# Altium schematic sheet Curr_Source_Buffer.SchDoc
size A; SheetNumber: 15; SheetTotal: 16
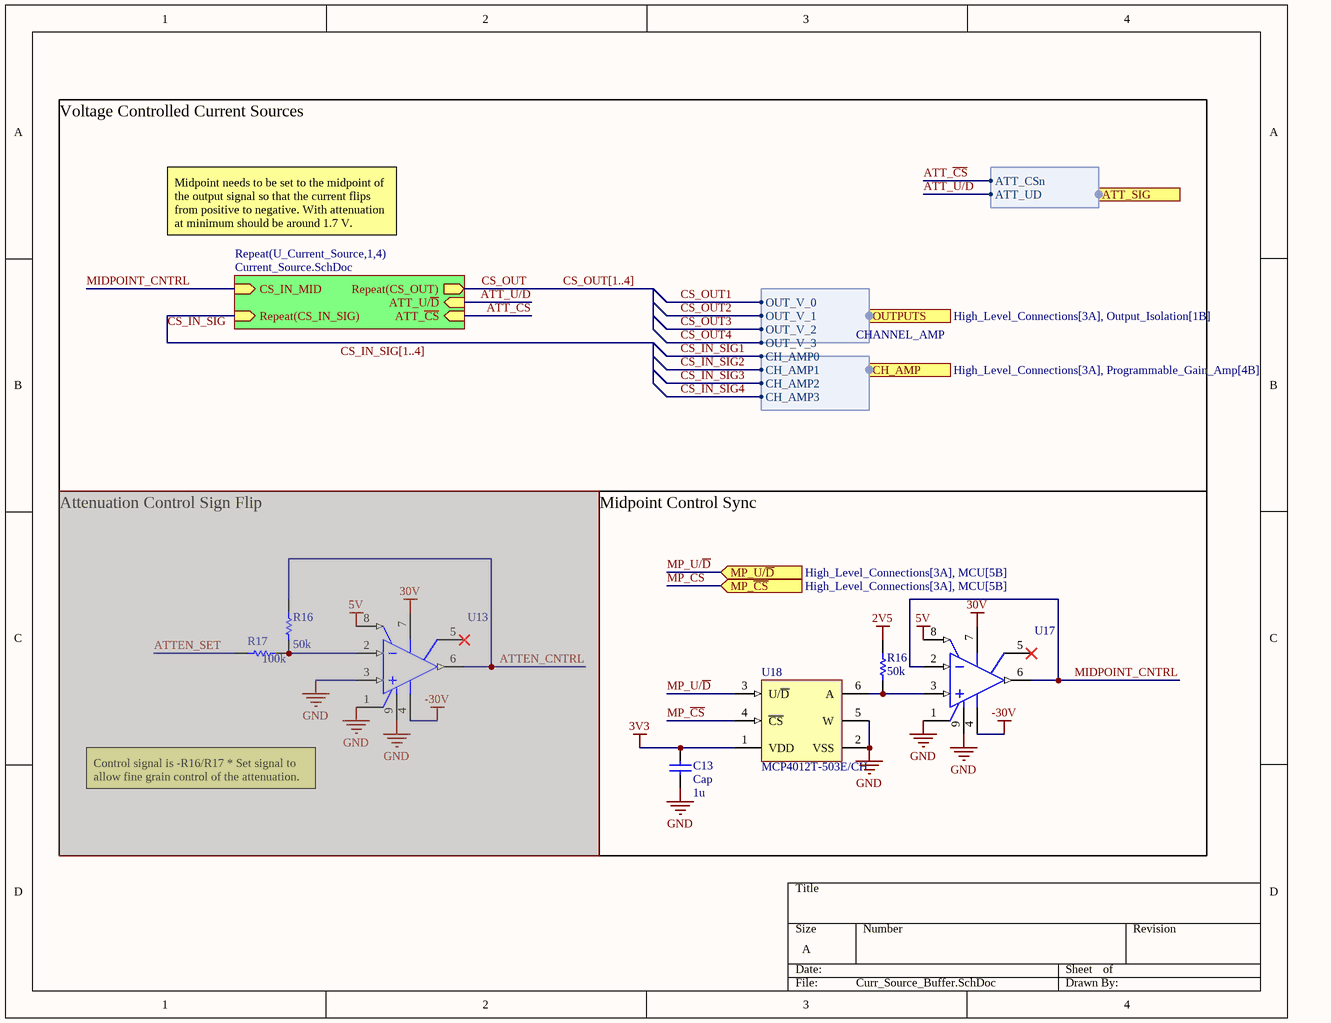
[diagram p0: Curr_Source_Buffer.SchDoc]

## Parts
(Parts that share a designator on the sheet are numbered #1, #2 ... from top to bottom, then left to right.)
C13  Cap  value 1u  [CAPC1608X05N]
R16#1  value 50k  [0402_Res]  (hidden comment: DNP)  (masked out: inside a compile mask, not in the netlist)
R16#2  value 50k  [0402_Res]  (hidden comment: DNP)
R17  value 100k  [0402_Res]  (hidden comment: DNP)  (masked out: inside a compile mask, not in the netlist)
U13  OPA454AIDDA  [DDA0008C_L]  (value not drawn)  (masked out: inside a compile mask, not in the netlist)
U17  OPA454AIDDA  [DDA0008C_L]  (value not drawn)
U18  MCP4012T-503E/CH  [SOT-23-CH6_M]

## Blocks framed on the sheet
Midpoint Control Sync: C13 R16#2 U17 U18

## Sub-sheets
Repeat(U_Current_Source,1,4) = Current_Source.SchDoc: CS_IN_MID (in), Repeat(CS_OUT) (out), Repeat(CS_IN_SIG) (in), ATT_U/~{D} (in), ATT_~{CS} (in)

## Ports
ATT_SIG (harness ATT), CH_AMP (in, harness CHANNEL_AMP, see High_Level_Connections[3A], Programmable_Gain_Amp[4B]), MP_U/~{D} (in, see High_Level_Connections[3A], MCU[5B]), MP_~{CS} (in, see High_Level_Connections[3A], MCU[5B]), OUTPUTS (harness OUTPUT_VOLTAGES, see High_Level_Connections[3A], Output_Isolation[1B])

## Harnesses
OUTPUT_VOLTAGES: OUT_V_0, OUT_V_1, OUT_V_2, OUT_V_3
CHANNEL_AMP: CH_AMP0, CH_AMP1, CH_AMP2, CH_AMP3
ATT: ATT_CSn, ATT_UD

## Nets
2V5: R16#2.1
3V3: C13.2 U18.1(VDD)
5V: U17.8(E/D)
30V: U17.7(V+)
-30V: U17.4(V-)
GND: C13.1 U17.1(E/D_COM) U17.9(EP) U18.2(VSS) U18.5(W)
ATT_~{CS}: sheet Repeat(U_Current_Source,1,4)/ATT_~{CS}, port ATT_SIG.ATT_CSn
ATT_U/~{D}: sheet Repeat(U_Current_Source,1,4)/ATT_U/~{D}, port ATT_SIG.ATT_UD
CS_IN_SIG: sheet Repeat(U_Current_Source,1,4)/Repeat(CS_IN_SIG)
CS_IN_SIG1: port CH_AMP.CH_AMP0
CS_IN_SIG2: port CH_AMP.CH_AMP1
CS_IN_SIG3: port CH_AMP.CH_AMP2
CS_IN_SIG4: port CH_AMP.CH_AMP3
CS_OUT: sheet Repeat(U_Current_Source,1,4)/Repeat(CS_OUT)
CS_OUT1: port OUTPUTS.OUT_V_0
CS_OUT2: port OUTPUTS.OUT_V_1
CS_OUT3: port OUTPUTS.OUT_V_2
CS_OUT4: port OUTPUTS.OUT_V_3
MIDPOINT_CNTRL: U17.2(IN-) U17.6(OUT) ; sheet Repeat(U_Current_Source,1,4)/CS_IN_MID
MP_~{CS}: U18.4(~{CS}) ; port MP_~{CS}
MP_U/~{D}: U18.3(U/~{D}) ; port MP_U/~{D}
NetR16#2_2: R16#2.2 U17.3(IN+) U18.6(A)

Not connected (* = marked no-connect by the designer): U17 5(STATUS_FLAG)*

## Buses and harness runs
bus CS_IN_SIG[1..4]
bus CS_OUT[1..4]

## Notes on the sheet
- Voltage Controlled Current Sources
- Midpoint needs to be set to the midpoint of the output signal so that the current flips from positive to negative. With attenuation at minimum should be around 1.7 V.
- Attenuation Control Sign Flip
- Control signal is -R16/R17 * Set signal to allow fine grain control of the attenuation.

## Library data of the parts
C13 = Cap: Capacitor; Published: 8-Jun-2000; LatestRevisionDate: 17-Jul-2002; LatestRevisionNote: Re-released for DXP Platform.; PackageReference: RAD-0.3; Publisher: Altium Limited; PackageDescription: Radial Cap, Thru-Hole; 2 Leads; 0.3 in Pin Spacing
R16#1 R16#2 R17 = Res1: Resistor; Published: 8-Jun-2000; LatestRevisionDate: 17-Jul-2002; LatestRevisionNote: Re-released for DXP Platform.; PackageReference: AXIAL-0.3; Publisher: Altium Limited; PackageDescription: Axial Device, Thru-Hole; 2 Leads; 0.3 in Pin Spacing
U13 U17 = CMP-0017-00714-2: High Voltage (100V), High-Current (50mA) Operational Amplifier, G=1 Stable, 10 to 100 V, -55 to 125 degC, 8-pin SOP (DDA8), Green (RoHS & no Sb/Br); Manufacturer: Texas Instruments; Number of Channels: 1; CMRR(Min)(dB): 100; Rating: Catalog; Total Supply Voltage(Min)(+5V is 5, +/-5V is 10): 10; Offset Drift(Typ)(uV/C): 1.6; Vn at 1kHz(Typ)(nV/rtHz): 47; Slew Rate(Typ)(V/us): 13; Sub Family: General Purpose Amplifier, High Output Current Amplifier (>=50mA), High Supply Voltage Amplifier (>=30V), Precision Amplifier; Iq per channel(Max)(mA): 4; GBW(Typ)(MHz): 2.5; Code_JEDEC: MS-012; ComponentLink3URL: http://www.ti.com/litv/pdf/mpds092e; ComponentLink1Description: Manufacturer URL; PackageDescription: 8-Pin PowerPAD(TM) Plastic Small Outline, Body 3.9 x 4.9 mm, Pitch 1.27 mm; PackageVersion: 4202561/F, 12/2011; ComponentLink3Description: Package Specification; ComponentLink2URL: http://www.ti.com/lit/ds/symlink/opa454.pdf; ComponentLink2Description: Datasheet; IIB(Max)(pA): 100; ComponentLink1URL: http://www.ti.com/; DatasheetVersion: SBOS391A; Total Supply Voltage(Max)(+5V is 5, +/-5V is 10): 100; Eco-Plan: Green (RoHS & no Sb/Br); Mounting Technology: Surface Mount; Vio (25C)(Max)(mV): 4; PackageReference: DDA0008C; PartNumber: OPA454AIDDA
U18 = CMP-0188-00744-2: Low-Cost 64-Step Volatile Digital POT, 6-Pin SOT-23, Extended Temperature, Tape and Reel; ComponentLink3Description: Package Specification; ComponentLink1Description: Manufacturer URL; PackageDescription: 6-Lead Plastic Small Outline Transistor (CH) [SOT-23]; ComponentLink2Description: Datasheet; ComponentLink3URL: http://www.microchip.com/stellent/groups/techpub_sg/documents/packagingspec/en012702.pdf; DatasheetVersion: revC, Dec-2006; PackageVersion: revBB, Aug-2009; Code_IPC: SOT26A-6; PackageReference: SOT-23-CH6; RevisionNote: URLs added.; ComponentLink2URL: http://ww1.microchip.com/downloads/en/DeviceDoc/21978c.pdf; ComponentLink1URL: http://www.microchip.com/